# EAGLE design coil-driver-3 (EAGLE 4.16)
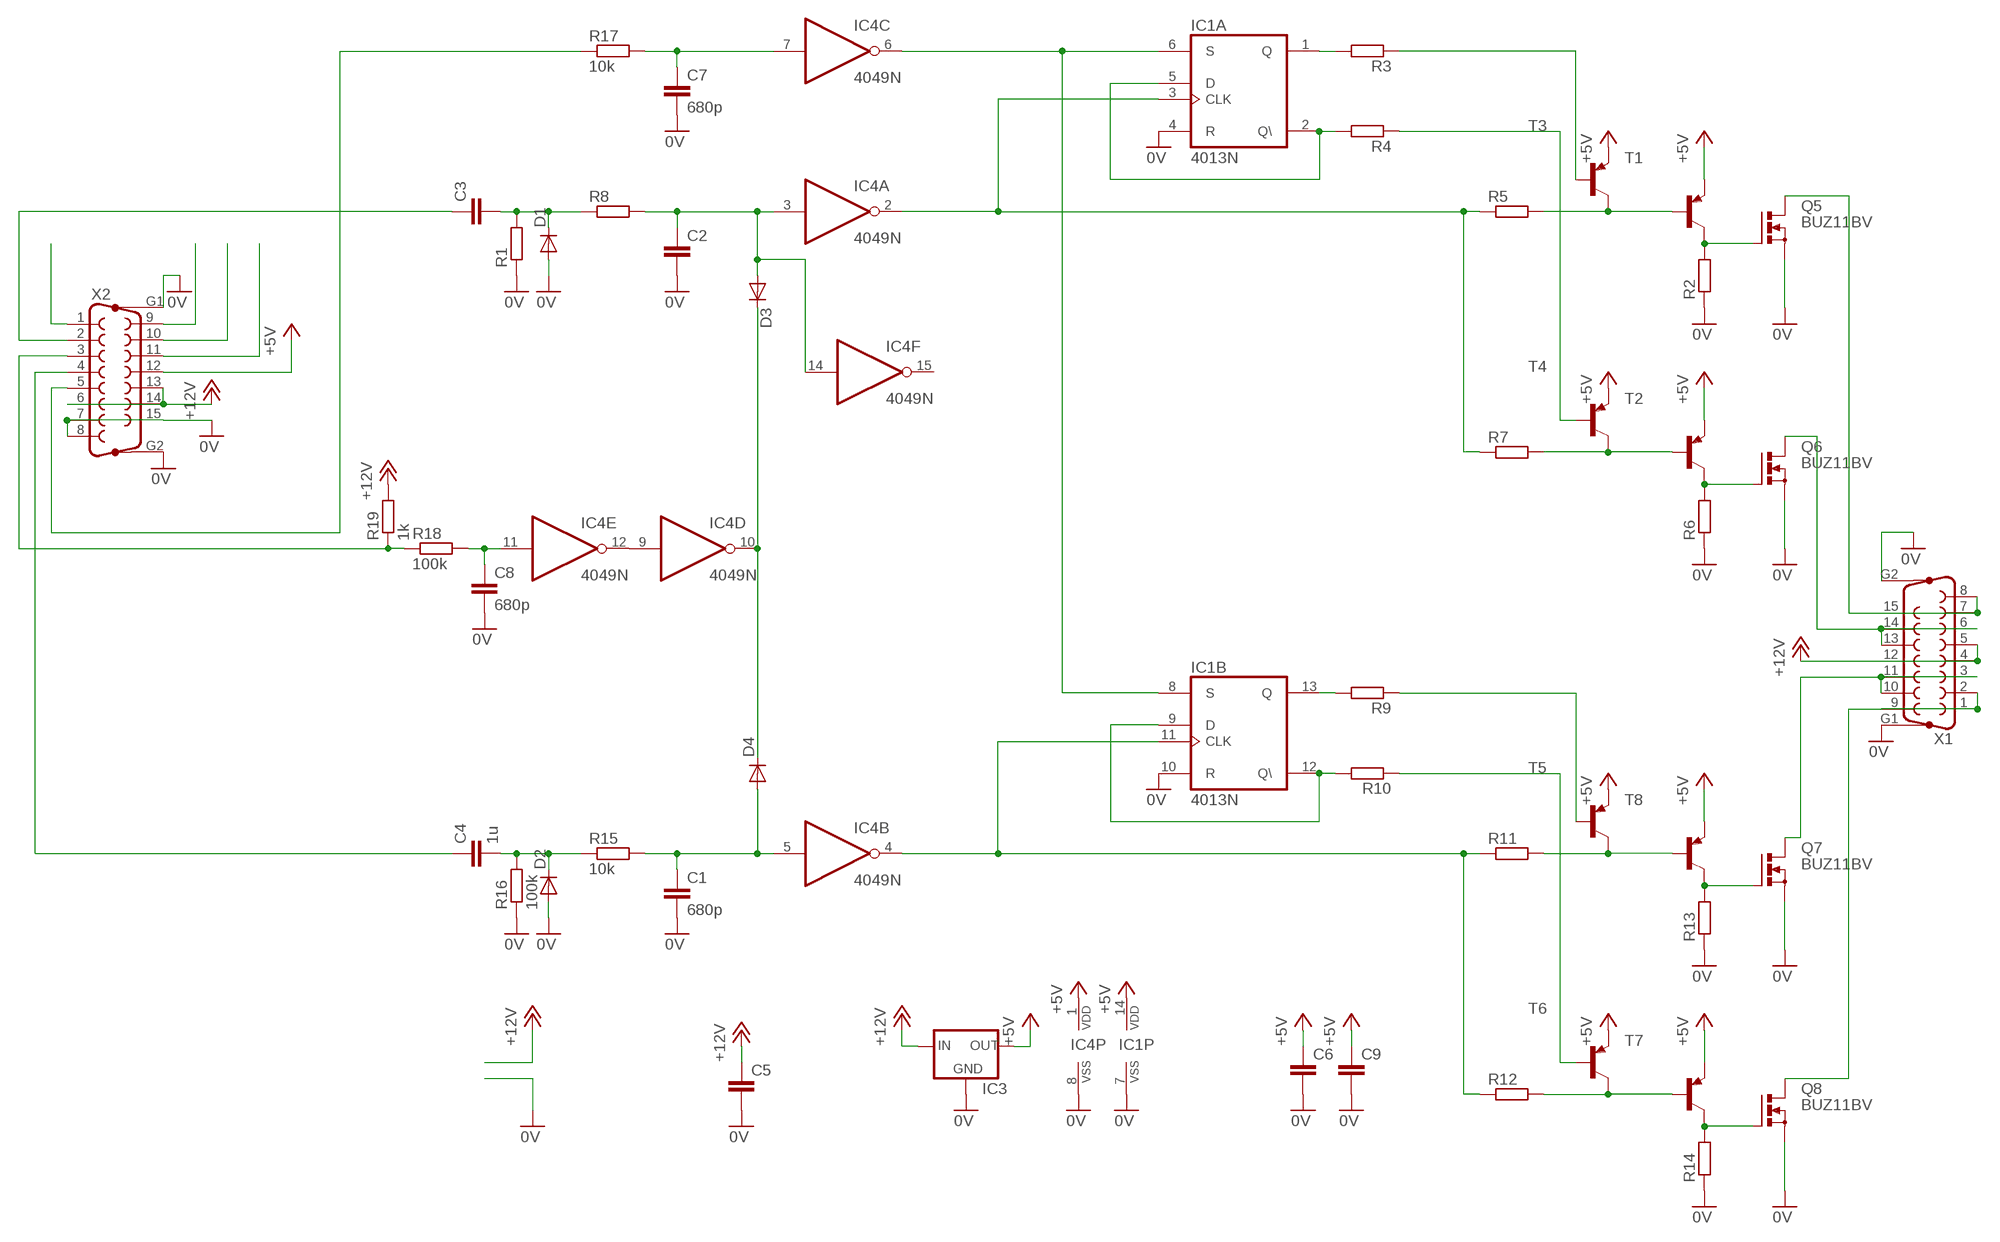
[diagram p0: schematic, sheet 1]

## Parts
C1  680p  C-EU050-030X075  [C050-030X075]
C2  C-EU050-030X075  [C050-030X075]
C3  C-EU050-030X075  [C050-030X075]
C4  1u  C-EU050-030X075  [C050-030X075]
C5  C-EU050-030X075  [C050-030X075]
C6  C-EU050-030X075  [C050-030X075]
C7  680p  C-EU050-030X075  [C050-030X075]
C8  680p  C-EU050-030X075  [C050-030X075]
C9  C-EU050-030X075  [C050-030X075]
D1  DIODE-D-7.5  [D-7.5]
D2  DIODE-D-7.5  [D-7.5]
D3  DIODE-D-7.5  [D-7.5]
D4  DIODE-D-7.5  [D-7.5]
IC1  4013N  [DIL14]
IC3  78XXS  [78XXS]
IC4  4049N  [DIL16]
Q5  BUZ11BV  [TO220BV]
Q6  BUZ11BV  [TO220BV]
Q7  BUZ11BV  [TO220BV]
Q8  BUZ11BV  [TO220BV]
R1  R-EU_0207/7  [0207/7]
R2  R-EU_0207/7  [0207/7]
R3  R-EU_0207/7  [0207/7]
R4  R-EU_0207/7  [0207/7]
R5  R-EU_0207/7  [0207/7]
R6  R-EU_0207/7  [0207/7]
R7  R-EU_0207/7  [0207/7]
R8  R-EU_0207/7  [0207/7]
R9  R-EU_0207/7  [0207/7]
R10  R-EU_0207/7  [0207/7]
R11  R-EU_0207/7  [0207/7]
R12  R-EU_0207/7  [0207/7]
R13  R-EU_0207/7  [0207/7]
R14  R-EU_0207/7  [0207/7]
R15  10k  R-EU_0207/7  [0207/7]
R16  100k  R-EU_0207/7  [0207/7]
R17  10k  R-EU_0207/7  [0207/7]
R18  100k  R-EU_0207/7  [0207/7]
R19  1k  R-EU_0207/7  [0207/7]
T1  BC557B-PNP-TO92-EBC  [TO92-EBC]
T2  BC557B-PNP-TO92-EBC  [TO92-EBC]
T3  BC557B-PNP-TO92-EBC  [TO92-EBC]
T4  BC557B-PNP-TO92-EBC  [TO92-EBC]
T5  BC557B-PNP-TO92-EBC  [TO92-EBC]
T6  BC557B-PNP-TO92-EBC  [TO92-EBC]
T7  BC557B-PNP-TO92-EBC  [TO92-EBC]
T8  BC557B-PNP-TO92-EBC  [TO92-EBC]
X1  F15HP  [F15HP]
X2  F15HP  [F15HP]

## Nets
0V: C1.2 C2.2 C5.2 C6.2 C7.2 C8.2 C9.2 D1.A D2.A IC1.4(A:R) IC1.7(P:VSS) IC1.10(B:R) IC3.GND IC4.8(P:VSS) Q5.S Q6.S Q7.S Q8.S R1.1 R2.1 R6.1 R13.1 R14.1 R16.1 X1.G1 X1.G2 X2.7 X2.8 X2.15 X2.G1 X2.G2
+5V: C6.1 C9.1 IC1.14(P:VDD) IC3.OUT IC4.1(P:VDD) T1.E T2.E T3.E T4.E T5.E T6.E T7.E T8.E X2.12
+12V: C5.1 IC3.IN R19.2 X1.4 X1.5 X1.12 X2.6 X2.13 X2.14
N$1: Q5.G R2.2 T1.C
N$3: IC1.1(A:Q) R3.2
N$4: IC1.2(A:Q\) IC1.5(A:D) R4.2
N$5: R3.1 T3.B
N$6: IC1.3(A:CLK) IC4.2(A:O) R5.1 R7.1
N$8: C2.1 D3.A IC4.3(A:I) IC4.14(F:I) R8.2
N$9: Q6.G R6.2 T2.C
N$10: R4.1 T4.B
N$11: R5.2 T1.B T3.C
N$12: IC1.11(B:CLK) IC4.4(B:O) R11.1 R12.1
N$13: IC1.13(B:Q) R9.2
N$14: R7.2 T2.B T4.C
N$15: C3.2 D1.C R1.2 R8.1
N$16: IC1.9(B:D) IC1.12(B:Q\) R10.2
N$17: R9.1 T5.B
N$18: R10.1 T6.B
N$19: Q7.G R13.2 T8.C
N$20: R11.2 T5.C T8.B
N$21: R12.2 T6.C T7.B
N$22: Q8.G R14.2 T7.C
N$24: Q8.D X1.1 X1.2 X1.9
N$25: C4.2 D2.C R15.1 R16.2
N$26: C1.1 D4.A IC4.5(B:I) R15.2
N$27: C4.1 X2.4
N$28: C3.1 X2.2
N$29: IC1.6(A:S) IC1.8(B:S) IC4.6(C:O)
N$30: C7.1 IC4.7(C:I) R17.2
N$31: Q7.D X1.3 X1.10 X1.11
N$32: R17.1 X2.5
N$35: Q6.D X1.6 X1.13 X1.14
N$36: Q5.D X1.7 X1.8 X1.15
N$37: IC4.9(D:I) IC4.12(E:O)
N$38: R18.1 R19.1 X2.3
N$39: C8.1 IC4.11(E:I) R18.2
N$40: D3.C D4.C IC4.10(D:O)
N$50: X2.9
N$51: X2.10
N$52: X2.11
N$53: X2.1
Unconnected: IC4.15(F:O)

## Library data of the parts
C1-C9 = rcl:C-EU: CAPACITOR, European symbol
D1-D4 = diode:DIODE-: DIODE
IC1 = 40xx:4013: Dual D FLIP FLOP, set/reset
IC3 = v-reg:78XXS: VOLTAGE REGULATOR
IC4 = 40xx:4049: Hex inverting BUFFER
Q5-Q8 = transistor-power:BUZ11: N-CHANNEL MOS FET
R1-R19 = rcl:R-EU_: RESISTOR, European symbol
T1-T8 = transistor:*-PNP-: PNP Transistror
X1 X2 = con-subd:F15HP: SUB-D

## Board
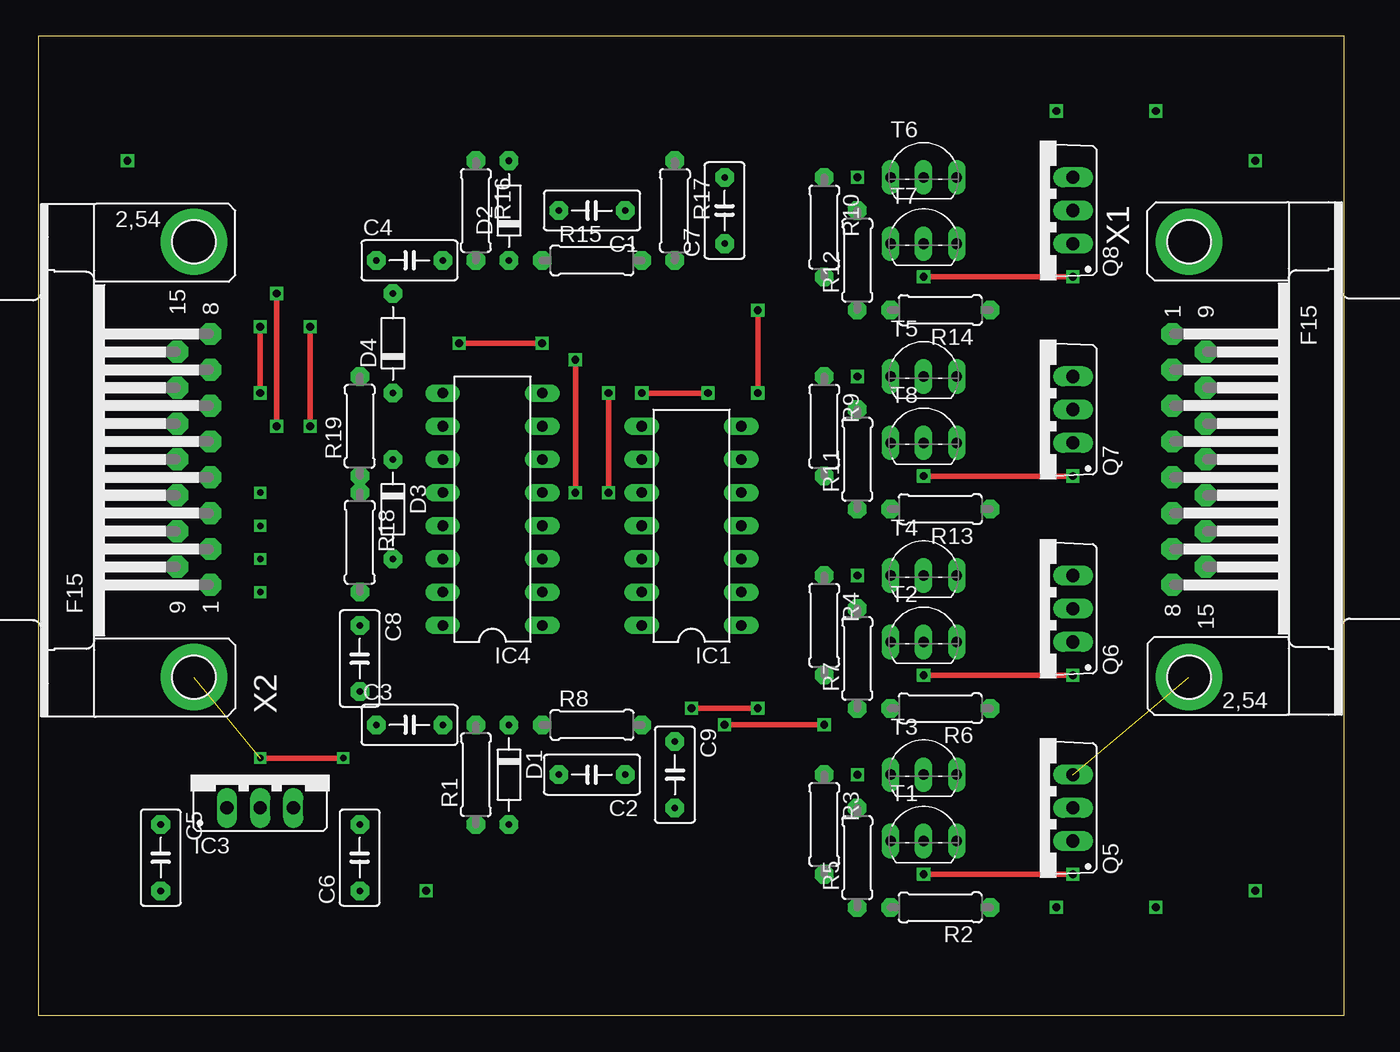
[diagram p1: board, top side]
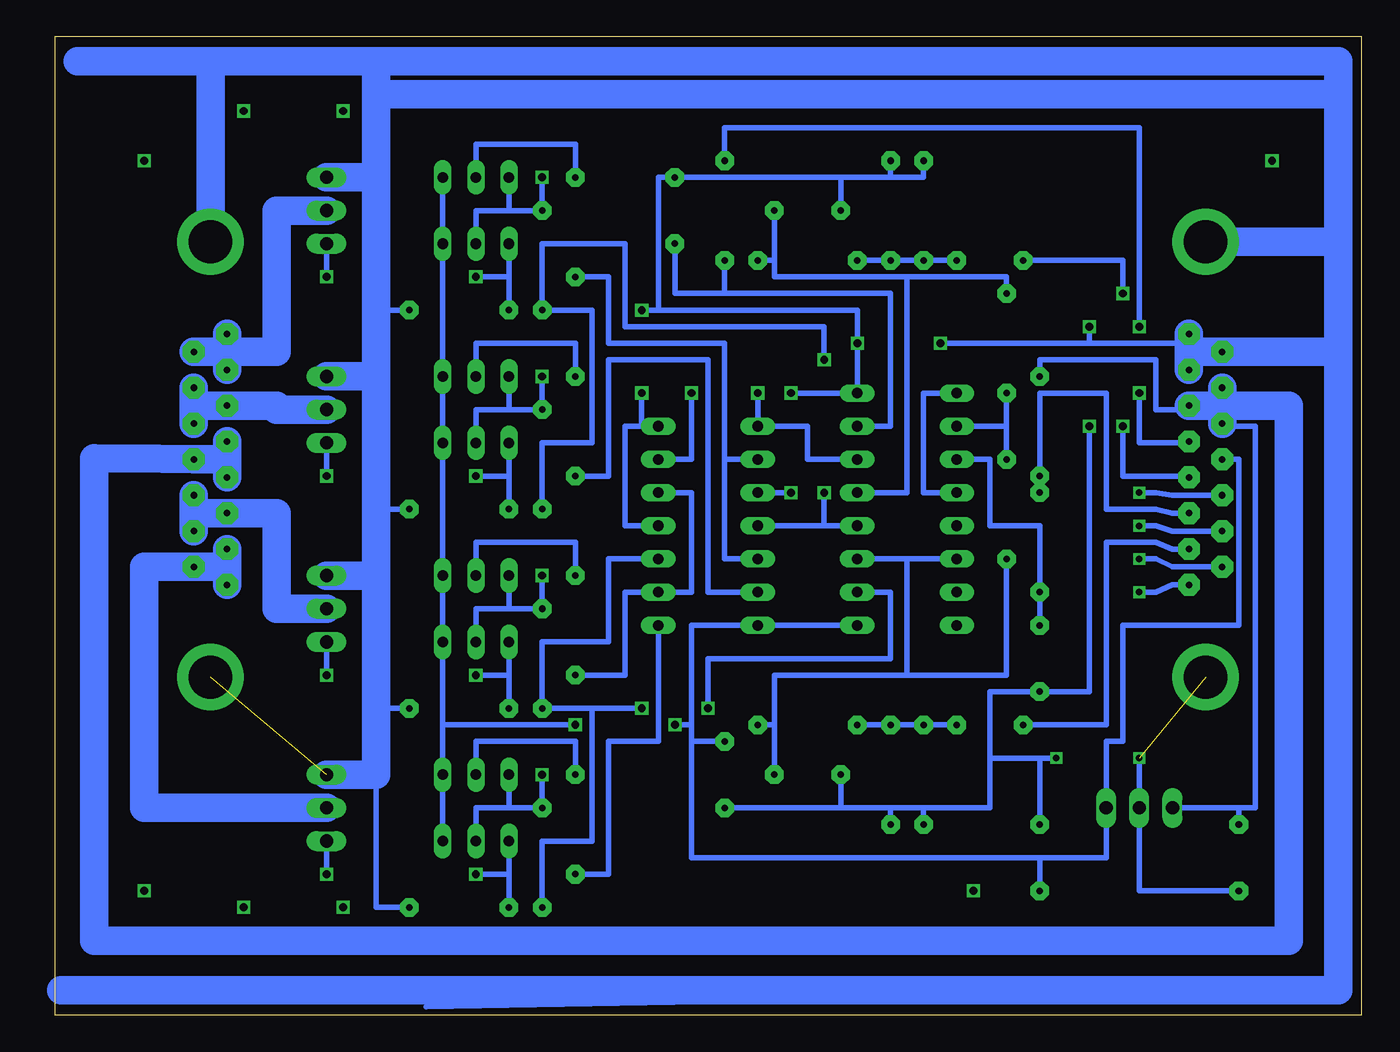
[diagram p2: board, bottom side, seen from below]

Size 100 x 74.92 mm. Coordinates in mm from the lower left corner, seen from the top.
Outline: 0,0 100,0 100,74.92 0,74.92 0,0
Copper layers (1*16): Top 0.035mm / dielectric 1.5mm / Bottom 0.035mm
Design rules "default": minimum track width 10mil, minimum drill 24mil, track to track 8mil, track to pad 8mil, pad to pad 8mil, via to via 8mil, smd to smd 8mil, copper to edge 40mil, drill to drill 8mil, minimum pad ring 10mil, minimum via ring 8mil, stop-mask expansion 4mil, vias tented up to drill 0mil, thermal gap 10mil
tKeepout: area 0.5,70.5 to 99.5,75.6; area 0.5,-0.6 to 99.5,4.4

### Footprints (pad centres in the part's own frame; a part is rotated, then mirrored left to right if it is on the bottom)
C050-030X075 = drill 0.5 pad 1.422 octagon: 1 -2.54,0; 2 2.54,0
D-7.5 = drill 0.5 pad 1.422 octagon: A 3.81,0; C -3.81,0
DIL14 = drill 0.813 long: 1 -7.62,-3.81; 2 -5.08,-3.81; 3 -2.54,-3.81; 4 0,-3.81; 5 2.54,-3.81; 6 5.08,-3.81; 7 7.62,-3.81; 8 7.62,3.81; 9 5.08,3.81; 10 2.54,3.81; 11 0,3.81; 12 -2.54,3.81; 13 -5.08,3.81; 14 -7.62,3.81
78XXS = drill 1.016 long: GND 0,-2.54; IN -2.54,-2.54; OUT 2.54,-2.54
DIL16 = drill 0.813 long: 1 -8.89,-3.81; 2 -6.35,-3.81; 3 -3.81,-3.81; 4 -1.27,-3.81; 5 1.27,-3.81; 6 3.81,-3.81; 7 6.35,-3.81; 8 8.89,-3.81; 9 8.89,3.81; 10 6.35,3.81; 11 3.81,3.81; 12 1.27,3.81; 13 -1.27,3.81; 14 -3.81,3.81; 15 -6.35,3.81; 16 -8.89,3.81
TO220BV = drill 1.016 long: D 0,-2.54; G -2.54,-2.54; S 2.54,-2.54
0207/7 = drill 0.5 pad 1.422 octagon: 1 -3.81,0; 2 3.81,0
TO92-EBC = drill 0.813 long: B 0,-1.27; C -2.54,-1.27; E 2.54,-1.27
F15HP = drill 0.5 pad 1.676 octagon: 1 -9.601,-1.27; 2 -6.858,-1.27; 3 -4.115,-1.27; 4 -1.372,-1.27; 5 1.372,-1.27; 6 4.115,-1.27; 7 6.858,-1.27; 8 9.601,-1.27; 9 -8.23,1.27; 10 -5.486,1.27; 11 -2.743,1.27; 12 0,1.27; 13 2.743,1.27; 14 5.486,1.27; 15 8.23,1.27 | drill 3.302 pad 5.08 round: G1 -16.662,0; G2 16.662,0

### Placement (x,y rotation side)
C1  42.38,61.59 180 top
C2  42.38,18.41 180 top
C3  28.41,22.22 0 top
C4  28.41,57.78 0 top
C5  9.36,12.06 270 top
C6  24.6,12.06 90 top
C7  52.54,61.59 90 top
C8  24.6,27.3 270 top
C9  48.73,18.41 270 top
D1  36.03,18.41 270 top
D2  36.03,61.59 90 top
D3  27.14,38.73 270 top
D4  27.14,51.43 90 top
IC1  50,37.46 90 top
IC3  16.98,18.41 0 top
IC4  34.76,38.73 90 top
Q5  76.67,15.87 90 top
Q6  76.67,31.11 90 top
Q7  76.67,46.35 90 top
Q8  76.67,61.59 90 top
R1  33.49,18.41 90 top
R2  69.05,8.25 180 top
R3  60.16,14.6 270 top
R4  60.16,29.84 270 top
R5  62.7,12.06 90 top
R6  69.05,23.49 180 top
R7  62.7,27.3 90 top
R8  42.38,22.22 0 top
R9  60.16,45.08 270 top
R10  60.16,60.32 270 top
R11  62.7,42.54 90 top
R12  62.7,57.78 90 top
R13  69.05,38.73 180 top
R14  69.05,53.97 180 top
R15  42.38,57.78 0 top
R16  33.49,61.59 270 top
R17  48.73,61.59 270 top
R18  24.6,36.19 270 top
R19  24.6,45.08 90 top
T1  67.78,14.6 0 top
T2  67.78,29.84 0 top
T3  67.78,19.68 0 top
T4  67.78,34.92 0 top
T5  67.78,50.16 0 top
T6  67.78,65.4 0 top
T7  67.78,60.32 0 top
T8  67.78,45.08 0 top
X1  88.1,42.54 270 top
X2  11.9,42.54 90 top

### Tracks (layer width: path | path; a pad name or v marks a point on that pad's centre or on a via)
0V  (via drill 0.5, 0.6)  (2 unrouted)
  Top 0.406: v43.65,47.62 v43.65,40 | v55.08,53.97 v55.08,47.62 | v32.22,51.43 v38.57,51.43 | v20.79,52.7 v20.79,45.08 | v23.33,19.68 v16.98,19.68
  Bottom 0.406: 36.03,64.13 33.49,64.13 R16.1 | 39.84,64.13 36.03,64.13 | 36.03,64.13 D2.A | 33.49,15.87 36.03,15.87 | 36.03,15.87 39.84,15.87 | 39.84,15.87 C2.2 | 33.49,15.87 R1.1 | 36.03,15.87 D1.A | X2.7 13.17,48.89 | 1.74,1.9 71.59,0.63 | 1.74,51.43 1.74,50.77 | 13.17,50.77 13.17,51.43 20.79,51.43 | v43.65,47.62 IC4.8 v38.57,51.43 38.57,53.97 v55.08,53.97 53.81,53.97 53.81,64.13 C7.2 39.84,64.13 | v43.65,40 IC1.10 | 1.74,59.05 1.74,59.2 | C5.2 16.98,9.52 IC3.GND v16.98,19.68 | 75.4,53.97 R14.1 | 75.4,38.73 R13.1 | 75.4,23.49 R6.1 | R2.1 75.4,8.25 75.4,18.41 | IC1.4 56.35,37.46 56.35,45.08 IC1.7 55.08,45.08 v55.08,47.62 | 20.79,51.43 v32.22,51.43 | v20.79,45.08 20.79,24.76 C8.2 28.41,24.76 28.41,19.68 | 20.79,51.43 v20.79,52.7 | 33.49,15.87 28.41,15.87 28.41,19.68 | 39.84,64.13 C1.2 | 39.84,15.87 C9.2 | 28.41,19.68 24.6,19.68 | 24.6,19.68 v23.33,19.68 | 24.6,19.68 C6.2
  Bottom 2.184: 75.4,33.65 75.4,23.49 75.4,18.41 Q5.S | 75.4,48.89 75.4,38.73 75.4,33.65 | 75.4,64.13 75.4,53.97 75.4,48.89 | 75.4,64.13 Q8.S | 75.4,48.89 Q7.S | 75.4,33.65 Q6.S | X2.7 13.17,51.43 X2.8 | 75.4,73.02 1.74,73.02 1.74,70.48 | 75.4,70.48 75.4,73.02 | 75.4,70.48 75.4,64.13 | 88.1,73.02 98.26,73.02 | 1.74,70.48 1.74,59.05 1.74,51.43 1.74,1.9 99.53,1.9 | 1.74,50.77 X2.15 13.17,50.77 | 1.74,59.2 X2.G2 | 75.4,73.02 88.1,73.02 | 88.1,73.02 X1.G1 | 1.74,70.48 75.4,70.48
+5V  (via drill 0.6)
  Top 0.406: v52.54,22.22 v60.16,22.22
  Bottom 0.406: T7.E T6.E T7.E | T8.E T5.E | T5.E T7.E | T1.E T3.E 70.32,22.22 | T4.E T2.E 70.32,22.22 | T4.E T8.E | IC4.1 IC1.14 51.27,29.84 51.27,22.22 | 51.27,20.95 51.27,12.06 24.6,12.06 | 51.27,20.95 51.27,22.22 | 24.6,12.06 19.52,12.06 IC3.OUT 19.52,20.95 18.25,20.95 18.25,29.84 9.36,29.84 9.36,42.54 X2.12 | 51.27,20.95 C9.1 | v60.16,22.22 70.32,22.22 | 51.27,22.22 v52.54,22.22 | T8.E T5.E | T4.E T5.E | 24.6,12.06 C6.1
+12V
  Bottom 0.406: R19.2 24.6,50.16 15.71,50.16 15.71,46.35 13.17,46.35 X2.6 | 9.36,15.87 C5.1 | 9.36,15.87 8.09,15.87 8.09,45.08 10.63,45.08 X2.13 | 9.36,15.87 IC3.IN
  Bottom 2.184: 86.83,42.54 X1.5 | 86.83,42.54 X1.12 | 86.83,42.54 96.99,42.64 96.99,5.71 5.55,5.71 5.55,46.66 X2.6 10.63,46.66 10.63,46.35 | 86.83,42.54 X1.4 | 10.63,46.35 X2.13 | 10.63,46.35 X2.14
N$1  (via drill 0.6)
  Top 0.406: v67.78,10.79 v79.21,10.79
  Bottom 0.406: v79.21,10.79 Q5.G | R2.2 65.24,10.79 | 65.24,10.79 v67.78,10.79 | 65.24,10.79 T1.C
N$2  (via drill 0.6)
  other vias: 77.94,8.25
N$3
  Bottom 0.406: R3.2 57.62,10.79 57.62,20.95 53.81,20.95 IC1.1
N$4
  Bottom 0.406: R4.2 56.35,26.03 56.35,32.38 IC1.2 51.27,32.38 51.27,40 IC1.5
N$5
  Bottom 0.406: T3.B 67.78,20.95 60.16,20.95 R3.1
N$6  (via drill 0.6)
  Top 0.406: v50,23.49 v55.08,23.49
  Bottom 0.406: IC1.3 57.62,34.92 57.62,28.57 62.7,28.57 R7.1 | v55.08,23.49 R7.1 | v50,23.49 50,27.3 36.03,27.3 36.03,32.38 IC4.2 | R7.1 58.89,23.49 58.89,13.33 62.7,13.33 R5.1
N$7  (via drill 0.6)
  other vias: 85.56,8.25
N$8
  Bottom 0.406: 44.92,22.22 C2.1 | 34.76,34.92 IC4.3 | 44.92,22.22 R8.2 | 44.92,22.22 44.92,26.03 34.76,26.03 | 34.76,26.03 34.76,34.92 | D3.A 27.14,26.03 34.76,26.03 | 34.76,34.92 IC4.14
N$9  (via drill 0.6)
  Top 0.406: v67.78,26.03 v79.21,26.03
  Bottom 0.406: 65.24,26.03 T2.C | v79.21,26.03 Q6.G | 65.24,26.03 v67.78,26.03 | R6.2 65.24,26.03
N$10
  Bottom 0.406: T4.B 67.78,36.19 60.16,36.19 R4.1
N$11  (via drill 0.6)
  Bottom 0.406: 65.24,15.87 T3.C | 65.24,15.87 67.78,15.87 T1.B | 65.24,15.87 R5.2 v62.7,18.41
N$12  (via drill 0.6)
  Top 0.406: v41.11,40 v41.11,50.16
  Bottom 0.406: IC4.4 41.11,37.46 | 41.11,37.46 IC1.11 | 41.11,37.46 v41.11,40 | v41.11,50.16 41.11,52.7 56.35,52.7 56.35,59.05 62.7,59.05 R12.1 58.89,53.97 58.89,43.81 62.7,43.81 R11.1
N$13
  Bottom 0.406: R9.2 57.62,41.27 57.62,50.16 50,50.16 50,32.38 IC1.13
N$14  (via drill 0.6)
  Bottom 0.406: 65.24,31.11 T4.C | 65.24,31.11 67.78,31.11 T2.B | 65.24,31.11 R7.2 v62.7,33.65
N$15
  Bottom 0.406: R1.2 37.3,22.22 | C3.2 R1.2 | R1.2 D1.C R8.1
N$16
  Bottom 0.406: 48.73,42.54 48.73,51.43 57.62,51.43 57.62,56.51 R10.2 | 48.73,42.54 IC1.9 | IC1.12 48.73,34.92 48.73,42.54
N$17
  Bottom 0.406: T5.B 67.78,51.43 60.16,51.43 R9.1
N$18
  Bottom 0.406: T6.B 67.78,66.67 60.16,66.67 R10.1
N$19  (via drill 0.6)
  Top 0.406: v67.78,41.27 v79.21,41.27
  Bottom 0.406: v79.21,41.27 Q7.G | R13.2 65.24,41.27 | 65.24,41.27 T8.C | 65.24,41.27 v67.78,41.27
N$20  (via drill 0.6)
  Bottom 0.406: 65.24,46.35 T5.C | 65.24,46.35 67.78,46.35 T8.B | 65.24,46.35 R11.2 v62.7,48.89
N$21  (via drill 0.6)
  Bottom 0.406: 65.24,61.59 T6.C | 65.24,61.59 67.78,61.59 T7.B | 65.24,61.59 R12.2 v62.7,64.13
N$22  (via drill 0.6)
  Top 0.406: v67.78,56.51 v79.21,56.51
  Bottom 0.406: v79.21,56.51 Q8.G | R14.2 65.24,56.51 | 65.24,56.51 T7.C | 65.24,56.51 v67.78,56.51
N$23  (via drill 0.6)
  other vias: 77.94,69.21
N$24
  Bottom 2.184: Q8.D 83.02,61.59 83.02,50.77 X1.9 86.83,50.77 86.83,51.43 | 86.83,51.43 X1.2 | 86.83,51.43 X1.1
N$25
  Bottom 0.406: C4.2 R16.2 | R16.2 37.3,57.78 | R16.2 D2.C R15.1
N$26
  Bottom 0.406: 44.92,57.78 R15.2 | 44.92,57.78 C1.1 | IC4.5 34.76,40 34.76,56.51 | 34.76,56.51 44.92,56.51 44.92,57.78 | 34.76,56.51 27.14,56.51 D4.A
N$27  (via drill 0.6)
  Top 0.406: v18.25,45.08 v18.25,55.24
  Bottom 0.406: X2.4 13.17,41.27 18.25,41.27 v18.25,45.08 | v18.25,55.24 18.25,57.78 C4.1
N$28
  Bottom 0.406: X2.2 14.44,35.68 15.71,36.19 19.52,36.19 19.52,22.22 C3.1
N$29  (via drill 0.6)
  Top 0.406: v46.19,47.62 v51.27,47.62
  Bottom 0.406: IC1.6 51.27,42.54 v51.27,47.62 | v46.19,47.62 IC1.8 42.38,45.08 42.38,42.54 IC4.6
N$30
  Bottom 0.406: IC4.7 36.03,45.08 36.03,55.24 48.73,55.24 | 48.73,55.24 R17.2 | 48.73,55.24 52.54,55.24 C7.1
N$31
  Bottom 0.406: X1.11 89.37,45.08
  Bottom 2.184: 89.37,46.35 X1.11 | 89.37,46.35 X1.10 | Q7.D 83.02,46.35 83.02,46.66 X1.3 89.37,46.66 89.37,46.35
N$32  (via drill 0.6)
  Top 0.406: v16.98,47.62 v16.98,52.7
  Bottom 0.406: X2.5 13.17,43.81 16.98,43.81 v16.98,47.62 | v16.98,52.7 16.98,67.94 48.73,67.94 R17.1
N$33  (via drill 0.6)
  other vias: 85.56,69.21
N$34  (via drill 0.6)
  other vias: 93.18,9.52
N$35
  Bottom 2.184: 89.37,37.46 X1.13 | Q6.D 83.02,31.11 83.02,38.43 X1.6 89.37,38.43 89.37,37.46 | 89.37,37.46 X1.14
N$36
  Bottom 0.406: X1.7 86.83,36.19
  Bottom 2.184: 86.83,34.92 X1.7 | 86.83,34.31 86.83,34.92 | 86.83,33.65 X1.8 | 86.83,34.92 86.83,33.65 | Q5.D 93.18,15.87 93.18,34.31 X1.15 86.83,34.31 | 86.83,34.31 86.83,33.65
N$37
  Bottom 0.406: IC4.9 33.49,47.62 33.49,40 IC4.12
N$38
  Bottom 0.406: R19.1 R18.1 24.6,47.62 19.52,47.62 19.52,38.73 15.71,38.73 14.44,38.43 X2.3
N$39
  Bottom 0.406: IC4.11 28.41,42.54 28.41,37.46 24.6,37.46 R18.2 C8.1
N$40
  Bottom 0.406: D4.C D3.C 27.14,45.08 IC4.10
N$41  (via drill 0.6)
  other vias: 93.18,65.4
N$42  (via drill 0.6)
  other vias: 6.82,65.4
N$43  (via drill 0.6)
  other vias: 29.68,9.52
N$48  (via drill 0.5)
  other vias: 16.98,40
N$49  (via drill 0.5)
  other vias: 16.98,37.46
N$50
  Bottom 0.406: X2.9 14.44,34.31 15.71,34.92 16.98,34.92
N$51
  Bottom 0.406: X2.10 14.44,37.05 15.71,37.46 16.98,37.46
N$52
  Bottom 0.406: X2.11 14.44,39.8 15.71,40 16.98,40 16.98,39.8
N$53
  Bottom 0.406: X2.1 14.44,32.94 15.71,32.38 16.98,32.38
N$54  (via drill 0.5)
  other vias: 16.98,34.92
N$55  (via drill 0.5)
  other vias: 16.98,32.38